# Altium schematic sheet 04_DEBUG_DISPLAY.SchDoc
size A4; SheetNumber: 3; SheetTotal: 4
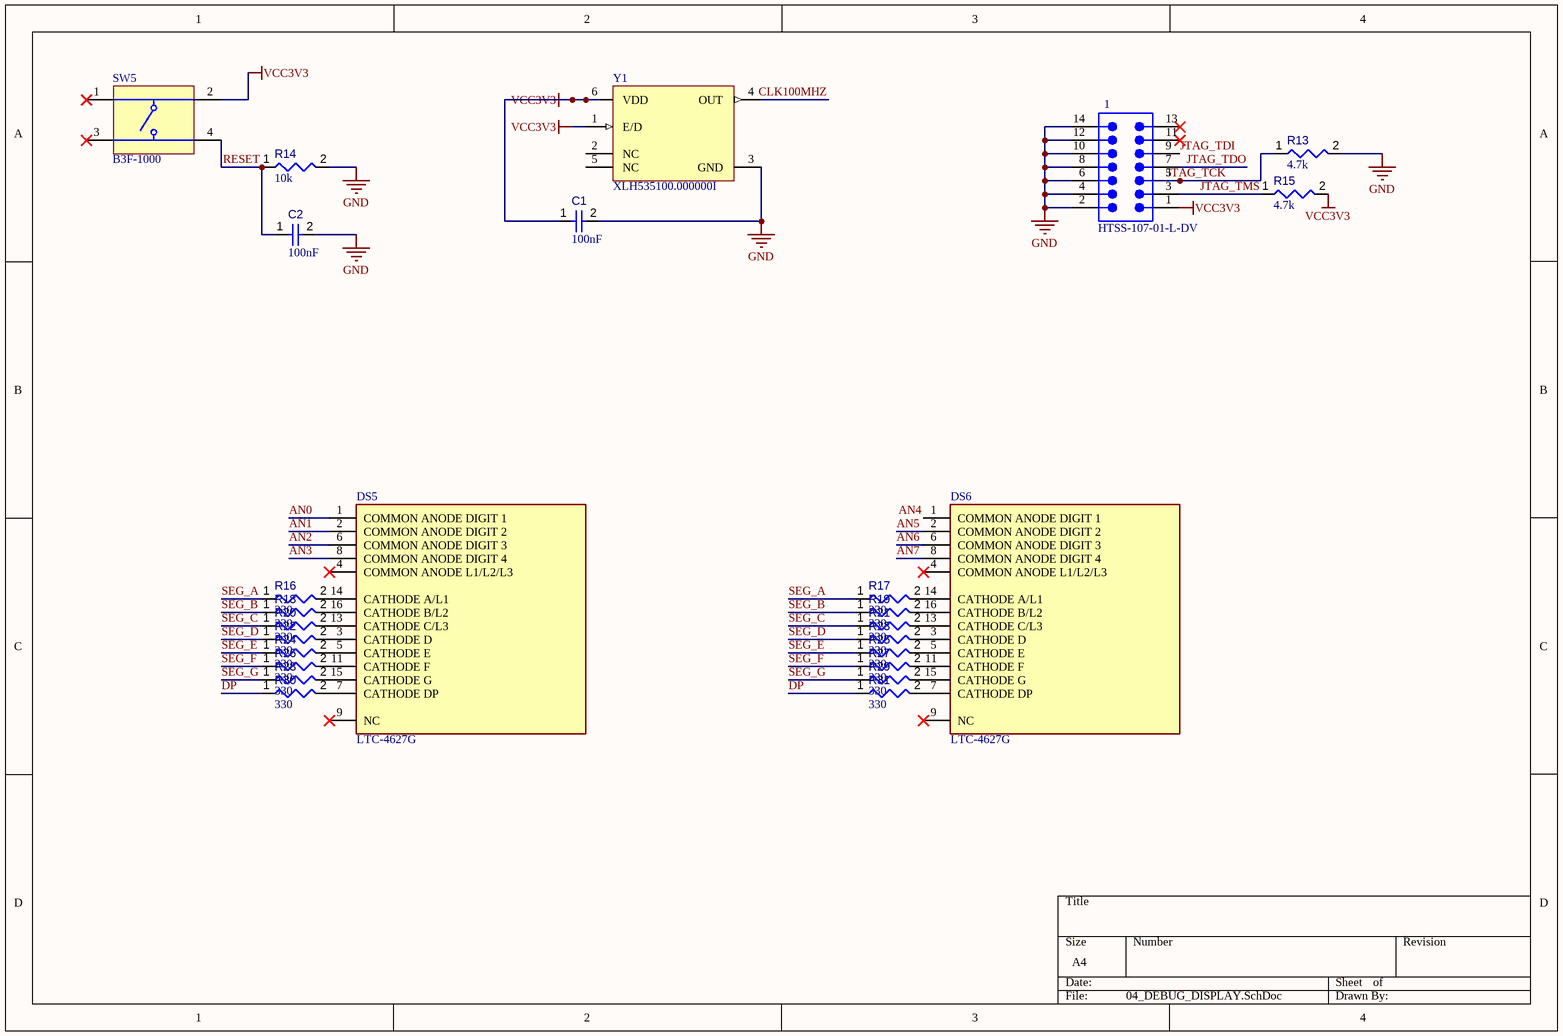
[diagram p0: 04_DEBUG_DISPLAY.SchDoc]

## Parts
1  HTSS-107-01-L-DV  [SMTC-HTSS-107-01-X-DV]
C1  value 100nF  [CAPC0402(1005)60_L]  (hidden comment: Capacitor 100nF +/-20% 25V 0402)
C2  value 100nF  [CAPC0402(1005)60_L]  (hidden comment: Capacitor 100nF +/-20% 25V 0402)
DS5  LTC-4627G  [FP-LTC-4627G-MFG]
DS6  LTC-4627G  [FP-LTC-4627G-MFG]
R13  value 4.7k  [RESC0402(1005)_L]  (hidden comment: Resistor 4K7  +/-1 % 0402 63 mW)
R14  value 10k  [RESC0402(1005)_L]  (hidden comment: 10KR2F)
R15  value 4.7k  [RESC0402(1005)_L]  (hidden comment: Resistor 4K7  +/-1 % 0402 63 mW)
R16  value 330  [RESC0402(1005)_L]  (hidden comment: 330R2J)
R17  value 330  [RESC0402(1005)_L]  (hidden comment: 330R2J)
R18  value 330  [RESC0402(1005)_L]  (hidden comment: 330R2J)
R19  value 330  [RESC0402(1005)_L]  (hidden comment: 330R2J)
R20  value 330  [RESC0402(1005)_L]  (hidden comment: 330R2J)
R21  value 330  [RESC0402(1005)_L]  (hidden comment: 330R2J)
R22  value 330  [RESC0402(1005)_L]  (hidden comment: 330R2J)
R23  value 330  [RESC0402(1005)_L]  (hidden comment: 330R2J)
R24  value 330  [RESC0402(1005)_L]  (hidden comment: 330R2J)
R25  value 330  [RESC0402(1005)_L]  (hidden comment: 330R2J)
R26  value 330  [RESC0402(1005)_L]  (hidden comment: 330R2J)
R27  value 330  [RESC0402(1005)_L]  (hidden comment: 330R2J)
R28  value 330  [RESC0402(1005)_L]  (hidden comment: 330R2J)
R29  value 330  [RESC0402(1005)_L]  (hidden comment: 330R2J)
R30  value 330  [RESC0402(1005)_L]  (hidden comment: 330R2J)
R31  value 330  [RESC0402(1005)_L]  (hidden comment: 330R2J)
SW5  B3F-1000  [OMRON-B3F-1000-4_V]
Y1  XLH535100.000000I  [JS6_MFG]

## Nets
GND: 1.2 1.4 1.6 1.8 1.10 1.12 1.14 C1.2 C2.2 R13.2 R14.2 Y1.3(GND)
VCC3V3: 1.1 C1.1 R15.2 SW5.2 Y1.1(E/D) Y1.6(VDD)
  RESET: C2.1 R14.1 SW5.4
AN0: DS5.1(COMMON_ANODE_DIGIT_1)
AN1: DS5.2(COMMON_ANODE_DIGIT_2)
AN2: DS5.6(COMMON_ANODE_DIGIT_3)
AN3: DS5.8(COMMON_ANODE_DIGIT_4)
AN4: DS6.1(COMMON_ANODE_DIGIT_1)
AN5: DS6.2(COMMON_ANODE_DIGIT_2)
AN6: DS6.6(COMMON_ANODE_DIGIT_3)
AN7: DS6.8(COMMON_ANODE_DIGIT_4)
CLK100MHZ: Y1.4(OUT)
DP: R30.1 R31.1
JTAG_TCK: 1.5 R13.1
JTAG_TDI: 1.9
JTAG_TDO: 1.7
JTAG_TMS: 1.3 R15.1
SEG_A: R16.1 R17.1
SEG_B: R18.1 R19.1
SEG_C: R20.1 R21.1
SEG_D: R22.1 R23.1
SEG_E: R24.1 R25.1
SEG_F: R26.1 R27.1
SEG_G: R28.1 R29.1
NetDS5_3: DS5.3(CATHODE_D) R22.2
NetDS5_5: DS5.5(CATHODE_E) R24.2
NetDS5_7: DS5.7(CATHODE_DP) R30.2
NetDS5_11: DS5.11(CATHODE_F) R26.2
NetDS5_13: DS5.13(CATHODE_C/L3) R20.2
NetDS5_14: DS5.14(CATHODE_A/L1) R16.2
NetDS5_15: DS5.15(CATHODE_G) R28.2
NetDS5_16: DS5.16(CATHODE_B/L2) R18.2
NetDS6_3: DS6.3(CATHODE_D) R23.2
NetDS6_5: DS6.5(CATHODE_E) R25.2
NetDS6_7: DS6.7(CATHODE_DP) R31.2
NetDS6_11: DS6.11(CATHODE_F) R27.2
NetDS6_13: DS6.13(CATHODE_C/L3) R21.2
NetDS6_14: DS6.14(CATHODE_A/L1) R17.2
NetDS6_15: DS6.15(CATHODE_G) R29.2
NetDS6_16: DS6.16(CATHODE_B/L2) R19.2

Not connected (* = marked no-connect by the designer): 1 11* 13*; DS5 4(COMMON_ANODE_L1/L2/L3)* 9(NC)*; DS6 4(COMMON_ANODE_L1/L2/L3)* 9(NC)*; SW5 1* 3*; Y1 2(NC) 5(NC)

## Library data of the parts
1 = CMP-1024-00047-1: Shrouded .025" SQ Post Header, Surface Mount, Vertical, -55 to 125 degC, 2.54 mm Pitch, 14-Pin, Male, RoHS; Manufacturer: Samtec; Pitch: 2.54 mm; ComponentLink3Description: Package Specification; ComponentLink1URL: http://www.samtec.com; Orientation: Vertical; PackageDescription: High Temp Top Shroud; PartNumber: HTSS-107-01-L-DV; RoHS: True; ComponentLink1Description: Manufacturer URL; Mounting Technology: Surface Mount; ComponentLink3URL: http://www.samtec.com/documents/webfiles/cpdf/HTSS-1XX-01-XX-DV-X-XX-X-XX-MKT.pdf; ComponentLink2Description: Datasheet; PackageReference: HTSS-107-01-X-DV; Temperature Range: -55 to 125 degC; PackageVersion: Z, 7/2001; DatasheetVersion: F-214; ComponentLink2URL: http://www.samtec.com/documents/webfiles/pdf/htss.pdf
C1 C2 = CMP-001-00065-4: Chip Capacitor, 100nF +/-20%, 25V, 0402, Thickness 0.6 mm; Tolerance: 10%; Max Operating Temperature: 85°C; Min Operating Temperature: -55°C; Pins: 2; Voltage Rating: 25V; Mounting Technology: SMT; Case/Package: 0402
DS5 DS6 = CMP-2000-06610-2: LED 7-SEG 4DIGIT GRN 0.4" CA; Manufacturer: Lite-On; Test Current: 20mA; Luminous Intensity: 2.2mcd; Wavelength: 569nm; Power Dissipation: 75mW; Element Config: Common Anode; Reverse Voltage: 5V; Description: Displays Segmented Panel 4DIGIT 35LED Green CA 16-Pin PDIP; Forward Voltage: 2.1V; Temperature Range Low: -35°C; Lead Free: Yes; Manufacturer Part Number: LTC-4627G; Height: 7.25mm; Package: 0; Device Class L1: Optoelectronics; Category: Disp; Mouser Description: LED Displays & Accessories 4 Digit, Green; Display Type: LED; Forward Current: 20mA; Device Class L2: Displays; Device Class L3: LED Displays; ComponentLink2Description: Datasheet; Octopart: https://octopart.com/ltc-4627g-lite-on-8442722; ComponentLink2URL: https://datasheet.ciiva.com/15136/getdatasheetpartid-630597-15136600.pdf; Automotive: No; Temperature: -35°C to +85°C; RoHS: TRUE; Temperature Range High: +85°C; Digikey Description: LED 7-SEG 4DIGIT GRN 0.4" CA
R13 R15 = CMP-009-00158-3: Chip Resistor, 4,7 kOhms, +/-1 %, 63 mW, -55 to 155 degC, 0402; Power: 63mW; Tolerance: 1%; Max Operating Temperature: 155°C; Pins: 2; Min Operating Temperature: -55°C; Case/Package: 0402
R14 = CMP-009-00066-2: 10K 0.063W 1% 0402 (1005 Metric)  SMD; Power: 63mW; Case/Package: 0402; Mounting Technology: SMT; Pins: 2; Tolerance: 1%
R16-R31 = CMP-009-00095-2: 330R 0.063W 5% 0402 (1005 Metric)  SMD; Power: 63mW; Tolerance: 5%; Mounting Technology: SMT; Case/Package: 0402; Pins: 2
SW5 = CMP-011-00004-2: Tactile Switch, SPST-NO, 0.05 A, 24 V, -25 to 70 degC, 4-Pin THD, RoHS, Bulk; Manufacturer: Omron Electronic Components; Throw Configuration: SPST; Max Contact Resistance: 100mohm; Resistance: 0.1Ohm; Max Current Rating: 50mA; Voltage Rating: 24V; Operating Force: 100gf; Datasheet Version: Jan-15; Case/Package: B3F-1000; Packaging: Bulk; Package Description: 4-Pin Through Hole Device, Body 6 x 6 mm; Manufacturer URL: http://www.omron.com/; Package Reference: B3F-1000; Contact Plating: Gold; Contact Current Rating: 50mA; RoHS Compliant: True; Contact Material: Gold; Mounting Technology: TH; Max Operating Temperature: 70°C; Min Operating Temperature: -25°C; Package Quantity: 1500; Datasheet URL: http://www.omron.com/ecb/products/pdf/en-b3f.pdf; Voltage Rating (DC): 24V; Pins: 4; Current Rating: 50mA; Max Voltage Rating (DC): 24V
Y1 = CMP-00572-106939965-3: Oscillator Xo 100MHZ ±50PPM 15PF Lvcmos 60% 3.3V 6-PIN Cllcc SMD T/r; Min Input Voltage: 3.135V; Max Output Frequency: 999.9MHz; Max Input Voltage: 3.465V; ComponentLink1URL: http://www.renesas.com; Output Type: LVCMOS; ComponentLink3Description: Manufacturer's Package Drawing; ComponentLink2URL: https://octopart.com/cad-content/api/get-model-datasheet/15189/106939965; Case/Package: CLCC; Max Operating Temperature: 85°C; Min Operating Temperature: -40°C; RoHS: Compliant; Height: 1.2mm; ComponentLink1Description: Manufacturer's Website; HelpURL: https://octopart.com/cad-content/api/get-model-datasheet/15189/106939965; ComponentLink3URL: https://www.renesas.com/en/document/psc/js6-package-outline-50-x-32-mm-body-11-mm-thick; Number of Pins: 6; ComponentLink2Description: Datasheet URL; Mount: Surface Mount